# Altium schematic sheet HP_LASER_PS.SchDoc: AI ARTIQ Driver
size 420 x 297 mm; Author: G.Kasprowicz; CompanyName: CTI; Organization: CTI; Address1: CTI; Address2: Nowowiejska 15/19 00-665 Warsaw; Address3: gkasprow@gmail.com; DocumentNumber: 10; Revision: 1.0; SheetNumber: 10; SheetTotal: 11; ModifiedBy: -; CheckedDate: -; Title2: HP LASER PS; DivGrp: CTI; ModifiedDate: -; ProjectName: Sensor Box
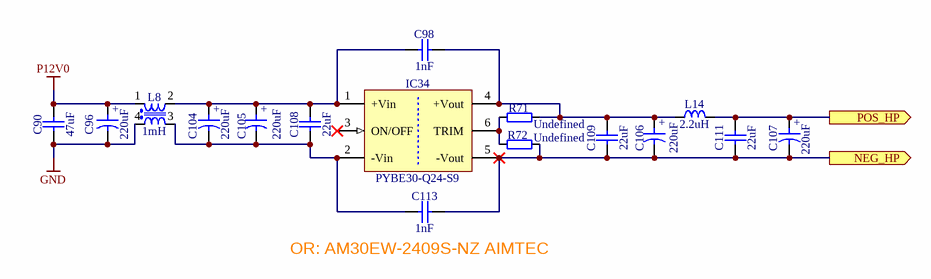
[diagram p0: HP_LASER_PS.SchDoc]

## Parts
C90  47uF  [CAPC3225X270N]
C96  220uF  [CAPAE830X1020N]
C98  1nF  [CAPC3216X180N]
C104  220uF  [CAPAE830X1020N]
C105  220uF  [CAPAE830X1020N]
C106  220uF  [CAPAE830X1020N]
C107  220uF  [CAPAE830X1020N]
C108  22uF  [CAPC3216X180N]
C109  22uF  [CAPC3216X180N]
C111  22uF  [CAPC3216X180N]
C113  1nF  [CAPC3216X180N]
IC34  PYBE30-Q24-S9  [DCDC_TRACO_TEN30]
L8  1mH  [IND_WURTH_WE-CMB-XS]
L14  2.2uH  [IND_BOURNS_SRR1260]
R71  Undefined  [RESC1608X55N]
R72  Undefined  [RESC1608X55N]

## Ports
NEG_HP (out), POS_HP (out)

## Nets
GND: C90.1 C96.2 L8.4
P12V0: C90.2 C96.1 L8.1
NEG_HP: C106.2 C107.2 C109.1 C111.1 C113.2 IC34.5(-Vout) R72.1 ; port NEG_HP
POS_HP: C107.1 C111.2 L14.2 ; port POS_HP
NetC98_1: C98.1 C104.1 C105.1 C108.2 IC34.1(+Vin) L8.2
NetC98_2: C98.2 C106.1 C109.2 IC34.4(+Vout) L14.1 R71.1
NetC104_2: C104.2 C105.2 C108.1 C113.1 IC34.2(-Vin) L8.3
NetIC34_6: IC34.6(TRIM) R71.2 R72.2

Not connected (* = marked no-connect by the designer): IC34 3(ON/OFF)*

## Notes on the sheet
- (near C113) OR: AM30EW-2409S-NZ AIMTEC
- Project/Equipment
- Document
- Designer
- Drawn by
- Check.by
- Copyright 2018.
  This documentation describes Open Hardware and is licensed under the CERN OHL v.1.1. You may redistribute and modify this documentation under the terms of the CERN OHL v.1.1. (http://ohwr.org/CERNOHL). This documentation is distributed WITHOUT ANY EXPRESS OR IMPLIED WARRANTY, INCLUDING OF MERCHANTABILITY, SATISFACTORY QUALITY AND FITNESS FOR A PARTICULAR PURPOSE. Please see the CERN OHL v.1.1 for applicable conditions.
- Contact
- File
- Last Mod.
- Print Date
- Sheet
- Size
- A3
- of
- Rev
- (in symbol CAE830-1020_220UF_25V_20%) +

## Library data of the parts
C90 = CC1210_47UF_16V_20%_X5R: Non-polarised capacitor; Part Description: SMD Multilayer Chip Ceramic Capacitor; Manufacturer: GENERIC; Manufacturer1 Part Number: EMK325BJ476MM-T; Voltage: 16V; TC: X5R; Tolerance: ±20%; Part Number: CC1210_47UF_16V_20%_X5R; Component Kind: Standard; Component Type: Standard; Pin Count: 2; Value: 47uF; Status: None; Manufacturer Part Number: CC1210_47UF_16V_20%_X5R; Case: 1210; Mounted: Yes; Socket: No; SMD: Yes; Sense: No; Manufacturer1 Example: TAIYO YUDEN; Manufacturer1 ComponentHeight: 2.7mm; HelpURL: \\cern.ch\dfs\Applications\Altium\Datasheets\CC1210_X5R_TAIYO-YUDEN_HIGH-VALUE.pdf; Author: CERN DEM MR; CreateDate: 03.02.2016; LatestRevisionDate: 03.02.2016
C96 C104-C107 = CAE830-1020_220UF_25V_20%: Polarised capacitor; Part Description: Aluminum Electrolytic SMT Capacitor; Manufacturer: PANASONIC; Manufacturer Part Number: EEEFK1E221AP; Voltage: 25V; Tolerance: ±20%; Part Number: CAE830-1020_220UF_25V_20%; Component Kind: Standard; Component Type: Standard; Pin Count: 2; Value: 220uF; Status: Not Recommended; Case: F; Mounted: Yes; Socket: No; SMD: Yes; Sense: No; ComponentHeight: 10.2mm; HelpURL: \\cern.ch\dfs\Applications\Altium\Datasheets\CAE_PANASONIC_FK.pdf; Author: CERN DEM JLC; CreateDate: 03.12.2007; LatestRevisionDate: 05.11.2014
C98 C113 = CC1206_1NF_2KV_10%_X7R: Non-polarised capacitor; Part Description: High Voltage MLC Chip Capacitor; Manufacturer: GENERIC; Manufacturer1 Part Number: 1206GC102KAT2A; Voltage: 2kV; TC: X7R; Tolerance: ±10%; Part Number: CC1206_1NF_2KV_10%_X7R; Component Kind: Standard; Component Type: Standard; Pin Count: 2; Value: 1nF; Status: None; Manufacturer Part Number: CC1206_1NF_2KV_10%_X7R; Case: 1206; Mounted: Yes; Socket: No; SMD: Yes; Sense: No; Manufacturer1 Example: AVX; Manufacturer1 ComponentHeight: 1.8mm; HelpURL: \\cern.ch\dfs\Applications\Altium\Datasheets\CC1206_X7R_AVX_HV-MLC.pdf; Author: CERN DEM JLC; CreateDate: 19.11.2012; LatestRevisionDate: 17.05.2017
C108 C109 C111 = CC1206_22UF_35V_20%_JB_TDK_C3216JB1V226M160AC: Non-polarised capacitor; Part Description: SMD Multilayer Chip Ceramic Capacitor; Manufacturer: TDK; Voltage: 35V; TC: JB(±10%); Tolerance: ±20%; Part Number: CC1206_22UF_35V_20%_JB_TDK_C3216JB1V226M160AC; Component Kind: Standard; Component Type: Standard; Pin Count: 2; Value: 22uF; Status: None; Manufacturer Part Number: C3216JB1V226M160AC; Case: 1206; Mounted: Yes; Socket: No; SMD: Yes; Sense: No; ComponentHeight: 1.8mm; HelpURL: \\cern.ch\dfs\Applications\Altium\Datasheets\CC1206_TDK_C3216JB1V226M160AC.pdf; Author: CERN DEM JLC; CreateDate: 13.07.2017; LatestRevisionDate: 13.07.2017
IC34 = TEN 30-2413: TRACO, TEN30 Series, Single Output DCDC Converter; Part Description: 18-36VDC to 15VDC, Iout (max) 2.0A, 30W DC-DC Converter; Manufacturer: CUI; PressFit: No; Bonding: No; Part Number: PYBE30-Q24-S9; Component Kind: Standard; Component Type: Standard; Device: PYBE30-Q24-S9; PackageDescription: TEN 30 Series, Body 51.3x25.9mm; Manufacturer Part Number: PYBE30-Q24-S9; Pin Count: 6; Mounted: Yes; Socket: No; SMD: No; Sense: No; ComponentHeight: 10.7mm; HelpURL: \\cern.ch\dfs\Applications\Altium\Datasheets\TEN 30-2413.pdf; Author: CERN DEM JMW; CreateDate: 07.06.2011; LatestRevisionDate: 06.01.2011
L8 = IND_1MH_30%_WURTH_WE-CMB-XS: Inductor Common Mode; Part Description: Common Mode Power Choke WE-CMB Series Type XS; Manufacturer: WURTH ELEKTRONIK; Manufacturer Part Number: 744821201; Power: 2A; Resistance: 0.045R; Tolerance: ±30%; Part Number: IND_1MH_30%_WURTH_WE-CMB-XS; Component Kind: Standard; Component Type: Standard; Pin Count: 4; Value: 1mH; Mounted: Yes; Socket: No; SMD: No; Sense: No; ComponentHeight: 18mm; HelpURL: \\cern.ch\dfs\Applications\Altium\Datasheets\IND_WURTH_WE-CMB_744821201.pdf; Author: CERN DEM JLC; CreateDate: 03.09.2012; LatestRevisionDate: 03.09.2012
L14 = IND_2.2UH_30%_BOURNS_SRR1260: Inductor; Part Description: Shielded SMD Power Inductor; Manufacturer: BOURNS; Manufacturer Part Number: SRR1260-2R2Y; Power: 8.2A; Resistance: 0.0105R; Tolerance: ±30%; Part Number: IND_2.2UH_30%_BOURNS_SRR1260; Component Kind: Standard; Component Type: Standard; Pin Count: 2; Value: 2.2uH; Status: None; Mounted: Yes; Socket: No; SMD: Yes; Sense: No; ComponentHeight: 6.5mm; HelpURL: \\cern.ch\dfs\Applications\Altium\Datasheets\IND_BOURNS_SRR1260.pdf; Author: CERN DEM JLC; CreateDate: 30.08.2010; LatestRevisionDate: 30.08.2010
R71 R72 = R0603_NO-VALUE: Resistor; Part Description: Reserved Footprint For a 0603 (1608) Chip Resistor; PressFit: No; Mounted: No; Part Number: R0603_NO-VALUE; Component Kind: Standard; Component Type: Standard; Pin Count: 2; Value: Undefined; Status: None; Manufacturer: Undefined; Manufacturer Part Number: R0603_NO-VALUE; Case: 0603; Sense: No; Socket: No; SMD: Yes; Manufacturer1 Example: Undefined; Manufacturer1 Part Number: Undefined; Manufacturer1 ComponentHeight: Undefined; HelpURL: Undefined; Author: CERN DEM JLC; CreateDate: 03.12.2007; LatestRevisionDate: 13.03.2008